# EasyEDA Pro project PCB_DengFOC V3PRO.epro

# Board PCB_DengFOC V3_2
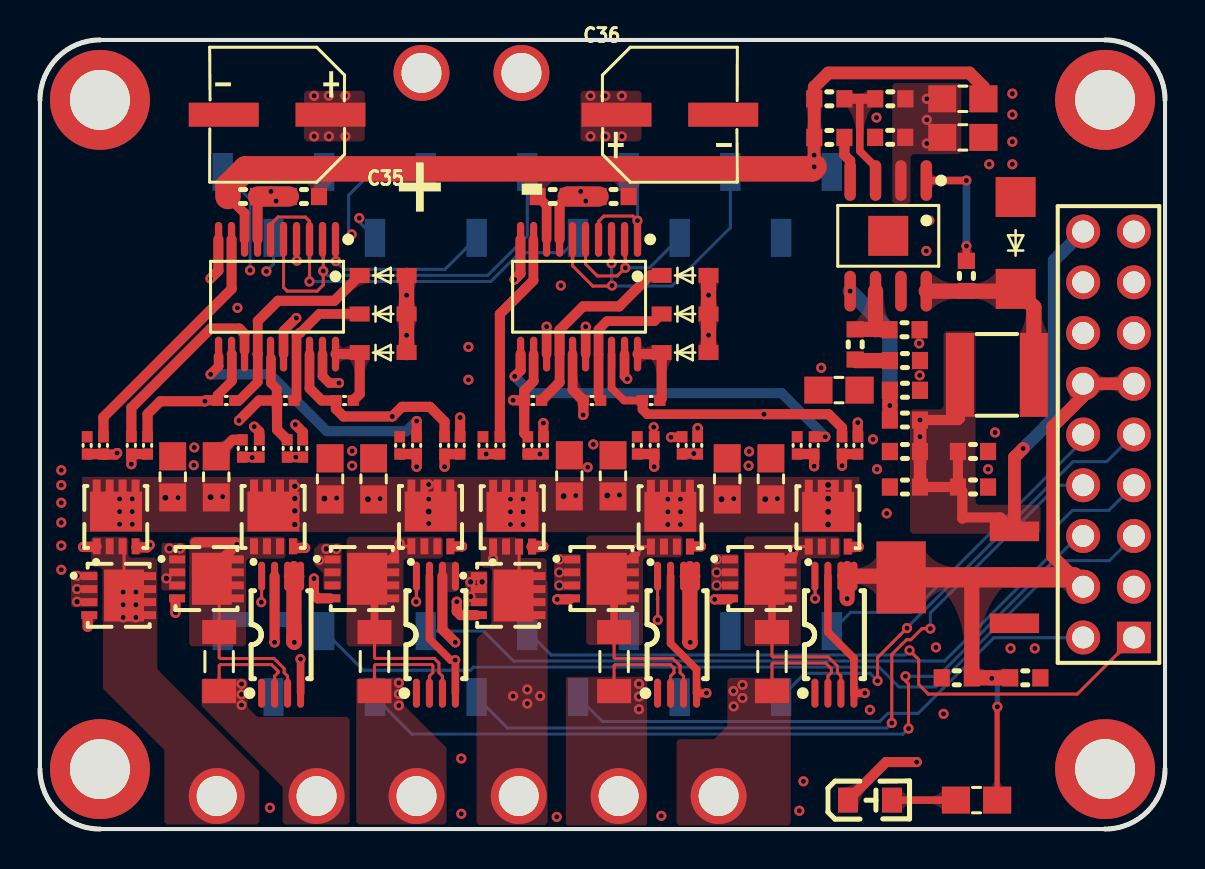
[diagram p0: board, top side]
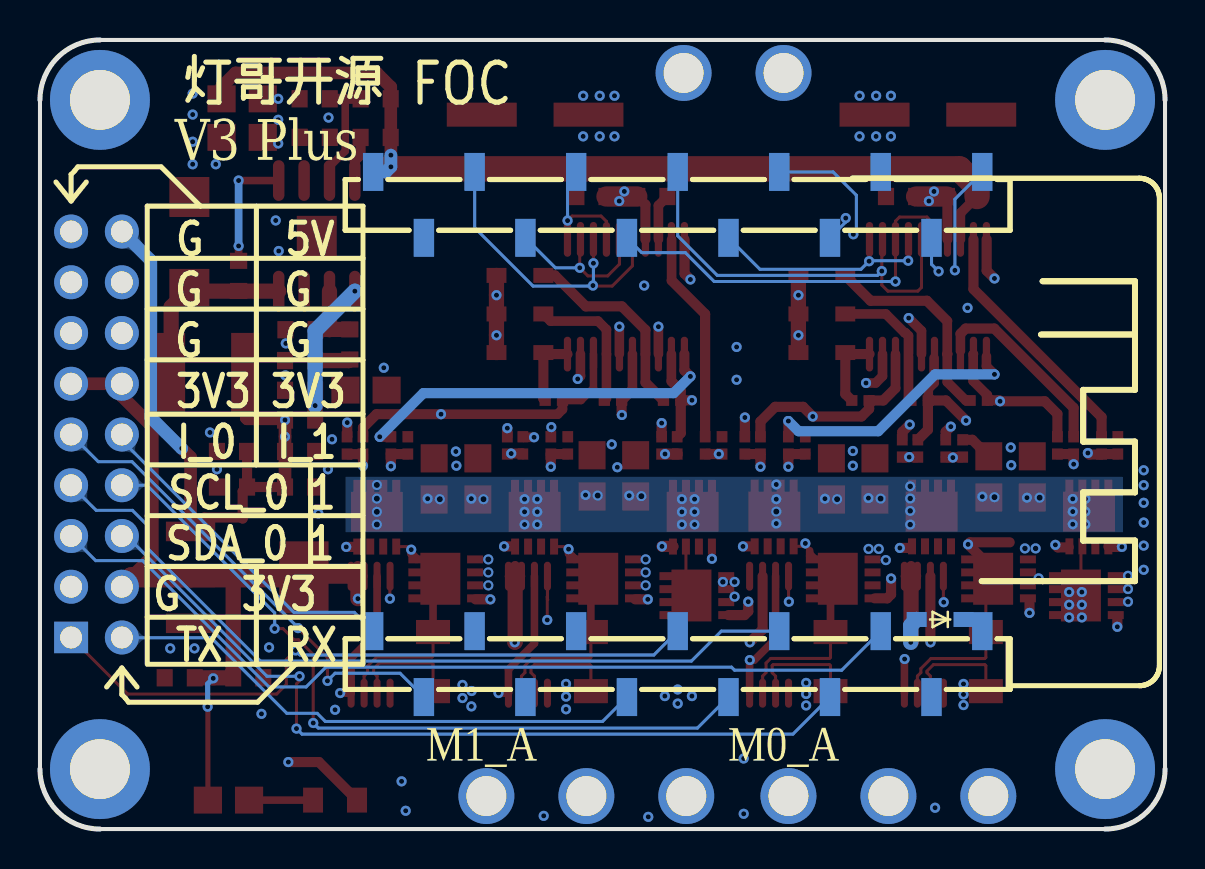
[diagram p1: board, bottom side, seen from below]

Outline 56.29 x 39.5 mm; copper layers: Top Layer, 内层1, 内层2, Bottom Layer. Coordinates in mm from the lower left corner of the outline.
Outline path: 0,36.5 arc(0.88,38.62) 3,39.5 53.29,39.5 arc(55.42,38.62) 56.29,36.5 56.29,3 arc(55.42,0.88) 53.29,0 3,0 arc(0.88,0.88) 0,3 0,36.5
Stack: Top Layer 0.035mm / Dielectric1 0.48mm PP er 4.5 / 内层1 0.035mm / Dielectric2 0.48mm FR4 er 4.5 / 内层2 0.035mm / Dielectric3 0.48mm PP er 4.5 / Bottom Layer 0.035mm

## Design rules (mm)
net M0_OUT2_N: DP1
net M0_OUT1_N: DP2
net M1_OUT2_N: DP3
net M1_OUT1_N: DP4
net M1_OUT1_P: DP4
net M0_OUT1_P: DP2
net M0_OUT2_P: DP1
net M1_OUT2_P: DP3
spacing Default (default): track to track 0.152, other pairs 0 to 0.152
track width Default (default): min 0.15, default 0.152, max 25.4
differential pair differentialPair (default): width min 0.127, default 0.254, max 2.54; gap min 0.152, default 0.152
via Default (default): diameter min 0.508, default 0.508, max 100.025; hole min 0.254, default 0.254, max 59.995
net PGND uses gge232172
net GND uses gge232286(1)

## Placement (name value [footprint] x y rotation side)
C1  47uF  [0603]  43.28 18.9 0 top
C2  47uF  [0603]  46.69 18.9 180 top
C3  4.7uF  [0805]  46.18 36.55 180 top
C4  100nF  [0603]  10.16 31.66 180 top
C5  100nF  [0603]  25.65 31.66 180 top
C7  10uF  [0805]  14.52 17.53 270 top
C8  4.7uF  [0805]  46.18 34.62 180 top
C9  100nF  [0402]  30.58 21.45 180 top
C10  100nF  [0603]  42.54 34.62 180 top
C11  10uF  [0805]  16.69 17.53 270 top
C12  8.2nF  [0603]  39.5 34.62 0 top
C13  100nF  [0402]  27.62 21.45 180 top
C14  1.2nF  [0603]  40.79 24.26 90 top
C15  10pF  [0603]  43.26 24.99 180 top
C16  100nF  [0402]  24.66 21.45 180 top
C17  100nF  [0603]  46.35 27.69 90 top
C18  10uF  [0805]  8.82 17.63 270 top
C19  10uF  [0805]  6.64 17.63 270 top
C21  100nF  [0402]  15.24 21.45 180 top
C23  100nF  [0402]  12.28 21.45 180 top
C24  100nF  [0603]  46.69 17.12 0 top
C25  10uF  [0805]  36.57 17.53 270 top
C26  100nF  [0603]  49.3 7.57 0 top
C27  22uF  [0603]  43.28 17.12 0 top
C28  22uF  [0603]  45.87 7.57 0 top
C29  100nF  [0402]  9.32 21.45 180 top
C30  10uF  [0805]  34.39 17.53 270 top
C31  10uF  [0805]  28.67 17.68 270 top
C32  10uF  [0805]  26.49 17.68 270 top
C33  1uF  [0603]  13.21 31.66 180 top
C34  1uF  [0603]  28.7 31.66 180 top
C35  100uF  [CAP-SMD_BD6.3-L6.6-W6.6-LS7.4-FD]  11.87 35.76 180 top
C36  100uF  [CAP-SMD_BD6.3-L6.6-W6.6-LS7.4-FD]  31.52 35.76 0 top
D2  SS34_C8678  [DO-214AC_L4.3-W2.7-LS5.3-RD]  48.82 29.34 90 top
D4  1N5819WS  [SOD-323_L1.8-W1.3-LS2.5-RD]  32.28 23.85 0 top
D6  1N5819WS  [SOD-323_L1.8-W1.3-LS2.5-RD]  32.28 25.78 0 top
D7  1N5819WS  [SOD-323_L1.8-W1.3-LS2.5-RD]  32.28 27.71 0 top
D8  1N5819WS  [SOD-323_L1.8-W1.3-LS2.5-RD]  17.17 27.71 0 top
D9  1N5819WS  [SOD-323_L1.8-W1.3-LS2.5-RD]  17.17 25.78 0 top
D10  1N5819WS  [SOD-323_L1.8-W1.3-LS2.5-RD]  17.17 23.85 0 top
D11  1N5819WS  [SOD-323_L1.8-W1.3-LS2.5-RD]  11.25 10.49 0 bottom
H1  Header-Female-2.54_2x9  [HDR-TH_18P-P2.54-V-R2-C9-S2.54]  53.47 19.75 90 top
H2  -  [SMD,P=2.54mm(交错脚)]  25.65 8.32 270 bottom
H3  -  [SMD,P=2.54mm(交错脚)]  25.65 31.31 270 bottom
L1  6.8uH  [IND-SMD_L5.0-W5.0_SWPA5040S]  47.88 22.73 180 top
LED1  17-21SUYC/TR8  [LED0805-RD]  41.53 1.45 0 top
NOREF  -  [Pad_e2262]  28.95 1.65 180 top
NOREF#2  -  [Pad_e2259]  13.84 1.65 180 top
NOREF#3  -  [Pad_e2068]  53.29 36.5 270 top
NOREF#4  -  [Pad_e2070]  19.09 37.85 180 top
NOREF#5  -  [Pad_e2069]  24.09 37.85 180 top
NOREF#6  -  [Pad_e2066]  3 3 270 top
NOREF#7  -  [Pad_e2260]  18.84 1.65 180 top
NOREF#8  -  [Pad_e2261]  23.96 1.65 180 top
NOREF#9  -  [Pad_e2263]  33.96 1.65 180 top
NOREF#10  -  [Pad_e2258]  8.84 1.65 180 top
NOREF#11  -  [Pad_e2067]  53.29 3 270 top
NOREF#12  -  [Pad_e2065]  3 36.5 270 top
Q1  WSD4070DN  [PDFN3333-8_L3.1-W3.2-P0.65-LS3.4-BL]  19.56 15.62 0 top
Q2  WSD4070DN  [PDFN3333-8_L3.1-W3.2-P0.65-LS3.4-BL]  16.1 12.52 270 top
Q3  WSD4070DN  [PDFN3333-8_L3.1-W3.2-P0.65-LS3.4-BL]  11.68 15.62 0 top
Q4  WSD4070DN  [PDFN3333-8_L3.1-W3.2-P0.65-LS3.4-BL]  8.33 12.52 270 top
Q5  WSD4070DN  [PDFN3333-8_L3.1-W3.2-P0.65-LS3.4-BL]  3.81 15.62 0 top
Q6  WSD4070DN  [PDFN3333-8_L3.1-W3.2-P0.65-LS3.4-BL]  3.94 11.68 270 top
Q7  WSD4070DN  [PDFN3333-8_L3.1-W3.2-P0.65-LS3.4-BL]  39.44 15.61 0 top
Q8  WSD4070DN  [PDFN3333-8_L3.1-W3.2-P0.65-LS3.4-BL]  35.99 12.52 270 top
Q9  WSD4070DN  [PDFN3333-8_L3.1-W3.2-P0.65-LS3.4-BL]  31.54 15.61 0 top
Q10  WSD4070DN  [PDFN3333-8_L3.1-W3.2-P0.65-LS3.4-BL]  28.09 12.52 270 top
Q11  WSD4070DN  [PDFN3333-8_L3.1-W3.2-P0.65-LS3.4-BL]  23.65 15.61 0 top
Q12  WSD4070DN  [PDFN3333-8_L3.1-W3.2-P0.65-LS3.4-BL]  23.43 11.68 270 top
R2  0  [0805]  39.98 21.97 0 top
R3  1K  [0805]  46.86 1.45 180 top
R4  330K  [0603]  42.55 36.55 0 top
R5  68K  [0603]  39.5 36.55 0 top
R6  30K  [0603]  43.28 23.45 180 top
R9  10K  [0603]  43.28 20.47 0 top
R10  1.87K  [0603]  43.28 21.96 180 top
R11  2.2Ω  [0402]  32.91 19.2 270 top
R12  2.2Ω  [0402]  30.73 19.2 270 top
R13  2.2Ω  [0402]  38.73 19.2 270 top
R14  2.2Ω  [0402]  40.93 19.2 270 top
R15  0.01  [R1206]  16.74 8.38 270 top
R16  0.01  [R1206]  8.97 8.38 270 top
R17  0.01  [R1206]  36.63 8.38 270 top
R18  0.01  [R1206]  28.73 8.38 270 top
R20  2.2Ω  [0402]  23.01 19.2 270 top
R21  2.2Ω  [0402]  25.19 19.2 270 top
R22  2.2Ω  [0402]  4.57 19.2 270 top
R23  2.2Ω  [0402]  3.17 19.2 270 top
R24  2.2Ω  [0402]  13.15 19.05 270 top
R25  2.2Ω  [0402]  10.97 19.05 270 top
R26  2.2Ω  [0402]  18.85 19.2 270 top
R27  2.2Ω  [0402]  21.02 19.2 270 top
R28  10kΩ  [R0402]  20.24 19.2 90 top
R29  10kΩ  [R0402]  18 19.2 90 top
R30  10kΩ  [R0402]  10.13 19.05 90 top
R31  10kΩ  [R0402]  12.37 19.05 90 top
R32  10kΩ  [R0402]  5.38 19.2 90 top
R33  10kΩ  [R0402]  2.36 19.2 90 top
R34  10kΩ  [R0402]  40.13 19.2 90 top
R35  10kΩ  [R0402]  37.89 19.2 90 top
R36  10kΩ  [R0402]  32.13 19.2 90 top
R37  10kΩ  [R0402]  29.89 19.2 90 top
R38  10kΩ  [R0402]  22.17 19.2 90 top
R39  10kΩ  [R0402]  24.41 19.2 90 top
U2  micropython esp32  [MICROPYTHON ESP32]  25.65 19.75 270 bottom
U3  TPS54331DDAR  [SOIC-8_L5.0-W4.0-P1.27-LS6.0-BL-EP]  42.44 29.69 180 top
U5  EG2133  [TSSOP-20_L6.5-W4.4-P0.65-LS6.4-BL]  26.97 26.64 180 top
U6  INA240A2PWR  [TSSOP-8_L4.4-W3.0-P0.65-LS6.4-BL]  19.81 9.73 0 top
U7  INA240A2PWR  [TSSOP-8_L4.4-W3.0-P0.65-LS6.4-BL]  12.06 9.73 0 top
U8  INA240A2PWR  [TSSOP-8_L4.4-W3.0-P0.65-LS6.4-BL]  39.75 9.73 0 top
U9  INA240A2PWR  [TSSOP-8_L4.4-W3.0-P0.65-LS6.4-BL]  31.88 9.73 0 top
U10  AMS1117-3.3  [SOT-223-4_L6.5-W3.5-P2.30-LS7.0-BR]  45.92 12.6 0 top
U11  EG2133  [TSSOP-20_L6.5-W4.4-P0.65-LS6.4-BL]  11.86 26.64 180 top

## Footprints (pads in the part's own frame, mm; a bottom-side part is the same pattern mirrored in y, then rotated)
0402
  rect 0.566x0.54 smd: 1(-0.433,0) 2(0.433,0)
0603
  rect 0.806x0.864 smd: 1(-0.753,0) 2(0.753,0)
0805
  rect 1.41x1.35 smd: 1(-1.03,0) 2(1.03,0)
CAP-SMD_BD6.3-L6.6-W6.6-LS7.4-FD
  rect 3.5x1.2 smd: 1(-2.67,0) 2(2.67,0)
DO-214AC_L4.3-W2.7-LS5.3-RD
  rect 2x2 smd: 1(-2.3,0) 2(2.3,0)
HDR-TH_18P-P2.54-V-R2-C9-S2.54
  rect 1.575x1.7 hole 1.1: 1(-10.16,-1.27)
  round 1.7 hole 1.1: 2(-10.16,1.27) 3(-7.62,-1.27) 4(-7.62,1.27) 5(-5.08,-1.27) 6(-5.08,1.27) 7(-2.54,-1.27) 8(-2.54,1.27) 9(0,-1.27) 10(0,1.27) 11(2.54,-1.27) 12(2.54,1.27) 13(5.08,-1.27) 14(5.08,1.27) 15(7.62,-1.27) 16(7.62,1.27) 17(10.16,-1.27) 18(10.16,1.27)
IND-SMD_L5.0-W5.0_SWPA5040S
  rect 1.4x4.2 smd: 1(-1.85,0) 2(1.85,0)
LED0805-RD
  rect 1x1.25 smd: 1(-1.1,0) 2(1.1,0)
Pad_e2065
  round 5 hole 3: N(0,0)
Pad_e2066
  round 5 hole 3: N(0,0)
Pad_e2067
  round 5 hole 3: N(0,0)
Pad_e2068
  round 5 hole 3: N(0,0)
Pad_e2069
  round 2.8 hole 2: 1(0,0)
Pad_e2070
  round 2.8 hole 2: 2(0,0)
Pad_e2258
  round 2.8 hole 2: 1(0,0)
Pad_e2259
  round 2.8 hole 2: 1(0,0)
Pad_e2260
  round 2.8 hole 2: 1(0,0)
Pad_e2261
  round 2.8 hole 2: 1(0,0)
Pad_e2262
  round 2.8 hole 2: 1(0,0)
Pad_e2263
  round 2.8 hole 2: 1(0,0)
PDFN3333-8_L3.1-W3.2-P0.65-LS3.4-BL
  rect 0.4x0.8 smd: 1(-0.975,-1.47) 2(-0.325,-1.47) 3(0.325,-1.47) 4(0.975,-1.47) 5(0.975,1.47) 6(0.325,1.47) 7(-0.325,1.47) 8(-0.975,1.47)
  rect 2.6x2 smd: 9(-0.004,0.27)
R0402
  rect 0.566x0.54 smd: 1(-0.433,0) 2(0.433,0)
R1206
  rect 1.208x1.701 smd: 1(-1.479,0) 2(1.479,0)
SMD,P=2.54mm(交错脚)
  rect 1.9x1.02 smd: 1(-1.587,16.51) 2(1.714,13.97) 3(-1.587,11.43) 4(1.714,8.89) 5(-1.587,6.35) 6(1.714,3.81) 7(-1.587,1.27) 8(1.714,-1.27) 9(-1.587,-3.81) 10(1.714,-6.35) 11(-1.587,-8.89) 12(1.714,-11.43) 13(-1.587,-13.97)
SOD-323_L1.8-W1.3-LS2.5-RD
  rect 1x0.75 smd: 1(-1.173,0) 2(1.173,0)
SOIC-8_L5.0-W4.0-P1.27-LS6.0-BL-EP
  oval 0.574x2.038 smd: 1(-1.905,-2.769) 2(-0.635,-2.769) 3(0.635,-2.769) 4(1.905,-2.769) 5(1.905,2.769) 6(0.635,2.769) 7(-0.635,2.769) 8(-1.905,2.769)
  rect 2x2 smd: 9(0,0)
SOT-223-4_L6.5-W3.5-P2.30-LS7.0-BR
  rect 2.47x0.98 smd: 1(2.835,-2.3) 2(2.835,0) 3(2.835,2.3)
  rect 2.47x3.6 smd: 4(-2.835,0)
TSSOP-8_L4.4-W3.0-P0.65-LS6.4-BL
  oval 0.353x1.454 smd: 1(-0.975,-2.927) 2(-0.325,-2.927) 3(0.325,-2.927) 4(0.975,-2.927) 5(0.975,2.927) 6(0.325,2.927) 7(-0.325,2.927) 8(-0.975,2.927)
TSSOP-20_L6.5-W4.4-P0.65-LS6.4-BL
  oval 0.364x1.742 smd: 1(-2.925,-2.871) 2(-2.275,-2.871) 3(-1.625,-2.871) 4(-0.975,-2.871) 5(-0.325,-2.871) 6(0.326,-2.871) 7(0.976,-2.871) 8(1.625,-2.871) 9(2.276,-2.871) 10(2.925,-2.871) 11(2.925,2.871) 12(2.276,2.871) 13(1.625,2.871) 14(0.976,2.871) 15(0.326,2.871) 16(-0.325,2.871) 17(-0.975,2.871) 18(-1.625,2.871) 19(-2.275,2.871) 20(-2.925,2.871)

## Nets
3V3: C26.1 C28.2 D11.2 H1.4 H1.11 H1.12 R3.1 U6.5 U6.6 U7.5 U7.6 U8.5 U8.6 U9.5 U9.6 U10.2 U10.4
5V: C1.2 C2.2 C4.1 C5.1 C24.1 C27.2 C33.2 C34.2 D4.2 D6.2 D7.2 D8.2 D9.2 D10.2 H1.18 L1.2 R9.2 U5.7 U10.3 U11.7
GND: C1.1 C2.1 C3.1 C4.2 C5.2 C8.1 C10.2 C12.1 C15.1 C24.2 C26.2 C27.1 C28.1 C33.1 C34.1 D2.2 H1.3 H1.13 H1.14 H1.15 H1.16 H1.17 H3.13 LED1.1 NOREF#3.N NOREF#11.N R2.2 R5.1 R6.1 R10.1 U3.7 U3.9 U5.8 U6.4 U6.7 U7.4 U7.7 U8.4 U8.7 U9.4 U9.7 U10.1 U11.8
PGND: C7.1 C11.1 C18.1 C19.1 C25.1 C30.1 C31.1 C32.1 C35.2 C36.2 NOREF#5.1 NOREF#6.N NOREF#12.N Q2.1 Q2.2 Q2.3 Q4.1 Q4.2 Q4.3 Q6.1 Q6.2 Q6.3 Q8.1 Q8.2 Q8.3 Q10.1 Q10.2 Q10.3 Q12.1 Q12.2 Q12.3 R2.1 R29.2 R30.2 R33.2 R35.2 R37.2 R38.2
VIN: C3.2 C7.2 C8.2 C10.1 C11.2 C18.2 C19.2 C25.2 C30.2 C31.2 C32.2 C35.1 C36.1 NOREF#4.2 Q1.5 Q1.6 Q1.7 Q1.8 Q1.9 Q3.5 Q3.6 Q3.7 Q3.8 Q3.9 Q5.5 Q5.6 Q5.7 Q5.8 Q5.9 Q7.5 Q7.6 Q7.7 Q7.8 Q7.9 Q9.5 Q9.6 Q9.7 Q9.8 Q9.9 Q11.5 Q11.6 Q11.7 Q11.8 Q11.9 R4.2 U3.2
I_0: H1.9 H2.12
I_1: H1.10 H2.13
M0_EN: H2.2
M0_GH1: R27.1 U11.19
M0_GH2: R24.1 U11.16
M0_GH3: R22.1 U11.13
M0_GL1: R26.1 U11.11
M0_GL2: R25.1 U11.10
M0_GL3: R23.1 U11.9
M0_IN1: H3.6 U11.1 U11.4
M0_IN2: H3.7 U11.2 U11.5
M0_IN3: H3.8 U11.3 U11.6
M0_OUT1_CS: H3.2 U6.8
M0_OUT1_N: NOREF#7.1 R15.2 U6.2
M0_OUT1_P: C21.2 Q1.1 Q1.2 Q1.3 Q2.5 Q2.6 Q2.7 Q2.8 Q2.9 R15.1 R28.2 U6.3 U11.18
M0_OUT2_CS: H3.1 U7.8
M0_OUT2_N: NOREF#2.1 R16.2 U7.2
M0_OUT2_P: C23.2 Q3.1 Q3.2 Q3.3 Q4.5 Q4.6 Q4.7 Q4.8 Q4.9 R16.1 R31.2 U7.3 U11.15
M0_OUT3: C29.2 NOREF#10.1 Q5.1 Q5.2 Q5.3 Q6.5 Q6.6 Q6.7 Q6.8 Q6.9 R32.2 U11.12
M1_EN: H3.12
M1_GH1: R14.1 U5.19
M1_GH2: R11.1 U5.16
M1_GH3: R21.1 U5.13
M1_GL1: R13.1 U5.11
M1_GL2: R12.1 U5.10
M1_GL3: R20.1 U5.9
M1_IN1: H3.9 U5.1 U5.4
M1_IN2: H3.10 U5.2 U5.5
M1_IN3: H3.11 U5.3 U5.6
M1_OUT1_CS: H3.5 U8.8
M1_OUT1_N: NOREF#9.1 R17.2 U8.2
M1_OUT1_P: C9.2 Q7.1 Q7.2 Q7.3 Q8.5 Q8.6 Q8.7 Q8.8 Q8.9 R17.1 R34.2 U5.18 U8.3
M1_OUT2_CS: H3.4 U9.8
M1_OUT2_N: NOREF.1 R18.2 U9.2
M1_OUT2_P: C13.2 Q9.1 Q9.2 Q9.3 Q10.5 Q10.6 Q10.7 Q10.8 Q10.9 R18.1 R36.2 U5.15 U9.3
M1_OUT3: C16.2 NOREF#8.1 Q11.1 Q11.2 Q11.3 Q12.5 Q12.6 Q12.7 Q12.8 Q12.9 R39.2 U5.12
RXD: H1.2 H2.8
SCL_0: H1.7 H2.5
SCL_1: H1.8 H2.6
SDA_0: H1.5 H2.3
SDA_1: H1.6 H2.4
TXD: H1.1 H2.7
$1N75: LED1.2 R3.2
$1N530: R9.1 R10.2 U3.5
$1N531: C17.1 D2.1 L1.1 U3.8
$1N532: C17.2 U3.1
$1N535: C14.2 C15.2 U3.6
$1N536: C12.2 U3.4
$1N538: R4.1 R5.2 U3.3
$1N1312: C23.1 D9.1 U11.17
$1N1315: C29.1 D8.1 U11.14
$1N1336: C21.1 D10.1 U11.20
$1N1359: C9.1 D4.1 U5.20
$1N1370: C16.1 D7.1 U5.14
$1N1373: C13.1 D6.1 U5.17
$1N1444: C14.1 R6.2
$1N6010: Q7.4 R14.2 R34.1
$1N6048: Q8.4 R13.2 R35.1
$1N6067: Q9.4 R11.2 R36.1
$1N6091: Q10.4 R12.2 R37.1
$1N6102: Q12.4 R20.2 R38.1
$1N6136: Q11.4 R21.2 R39.1
$1N6143: Q6.4 R23.2 R33.1
$1N6154: Q5.4 R22.2 R32.1
$1N6178: Q4.4 R25.2 R30.1
$1N6189: Q3.4 R24.2 R31.1
$1N6225: Q2.4 R26.2 R29.1
$1N6232: Q1.4 R27.2 R28.1
$1N7980: D11.1 H2.1

Pads without a net: H2 9 10 11; H3 3; U6 1; U7 1; U8 1; U9 1

## Via types
v1: diameter 0.508, hole 0.254, Top Layer to Bottom Layer, 220 vias
v2: diameter 0.508, hole 0.305, Top Layer to Bottom Layer, 19 vias
v3: diameter 0.508, hole 0.28, Top Layer to Bottom Layer, 16 vias

## Routing (per net, layer and track width the routed paths; a pad name or vN(x,y) marks a point on that pad's centre or on a via; arc(x,y) is an arc through that point)
3V3: length 83.8
  Top Layer w0.254: v1(47.62,7.54) 47.62,7.55 47.62,7.57 ; R3.1 47.89,6.11 v1(47.9,6.12)
  Top Layer w0.381: U9.5 U9.6 ; U7.6 U7.5 ; U8.6 40.39,12.66
  Top Layer w0.508: v1(20.78,9.35) 20.14,9.99 U6.6 ; 40.39,13.16 40.39,12.66 ; 32.52,13.16 32.52,12.66 ; 12.71,13.16 12.71,12.66
  Top Layer w0.635: 51.73,12.6 50.67,13.65 50.67,20.14 52.2,21.67 H1.12 H1.11
  Top Layer w0.762: U10.4 43.03,12.66 U8.5 ; 32.52,12.66 32.52,9.37 v1(32.54,9.35) ; 12.71,12.66 12.71,9.61 12.7,9.6 12.7,9.37 v1(12.73,9.35) ; 40.39,12.66 U8.5 ; U8.5 40.39,12.32 v1(40.39,11.53) ; C26.1 C28.2 46.63,12.49 46.73,12.6
  Top Layer w1.016: U10.4 U10.2 51.73,12.6 H1.4
  内层2 w0.762: v1(40.39,11.53) 40.39,10.26 39.47,9.35 v1(32.54,9.35) v1(20.78,9.35) v1(12.73,9.35)
  Bottom Layer w0.254: v1(47.9,6.12) 47.9,7.26 v1(47.62,7.54)
  Bottom Layer w0.762: v1(12.73,9.35) 12.73,10.19 D11.2
5V: length 98.4
  Top Layer w0.508: 45.93,18.9 45.93,17.12 ; 45.93,17.12 C27.2 ; 45.93,17.12 46.15,16.9 46.15,15.55 46.2,15.6 48.06,15.6 U10.3 ; v1(44.03,20.47) 45.95,20.47 46.03,20.55 L1.2 ; U5.7 26,31.25 C5.1 ; U11.7 10.89,31.63
  Top Layer w0.635: C27.2 C1.2 v1(44.03,19.64) v1(44.03,20.47) ; v1(49.2,19.05) 48.76,18.61 U10.3
  Top Layer w0.762: D10.2 D9.2 D8.2 ; 33.45,27.71 v1(33.45,26.72) v1(33.45,24.71) ; 33.45,24.71 D4.2
  Top Layer w1.016: C34.2 C5.1 ; C33.2 C4.1
  内层2 w0.762: v1(33.45,24.71) v1(33.45,26.72) 35.92,29.18 36.04,29.18 ; 18.38,31.72 18.34,31.69 v1(18.34,26.72) v1(18.34,24.71)
  内层2 w1.27: 36.04,29.18 36.04,29.21 ; 36.04,29.18 33.5,31.72 11.75,31.72 ; 36.04,29.18 44.03,21.2 v1(44.03,20.47) v1(44.03,19.64)
  Bottom Layer w0.635: v1(49.2,19.05) 50.75,20.6 50.75,28.46 H1.18
  vias: v1(11.56,31.92) v1(11.82,31.43) v1(27.06,31.92) v1(27.31,31.43)
GND: length 112.3
  Top Layer w0.381: U6.4 20.79,8.45 v1(20.78,8.46) 20.55,8.46 19.49,9.52 U6.7 ; v1(13.03,8.51) 13.04,8.5 U7.4 ; v1(33.35,6.81) 33.34,6.8 U9.4 32.85,7.99 31.55,9.29 U9.7 ; 39.43,12.66 39.43,9.85 40.73,8.55 U8.4 41.27,6.8 v1(41.28,6.81)
  Top Layer w0.482: C5.2 25.35,31.21 U5.8 ; U11.8 10.24,30.83 C4.2
  Top Layer w0.508: v1(43.87,3.35) 42.33,3.35 LED1.1 ; v1(11.73,9.35) 11.74,9.35 U7.7
  Top Layer w0.635: v1(38.73,33.15) v1(38.73,33.73) 38.73,34.61 C12.1 R5.1 38.74,37.14 39.45,37.85 46.51,37.85 47.21,37.15 C3.1
  Top Layer w1.27: v1(38.73,33.15) 38.63,33.05 10.29,33.05 9.41,32.17 C4.2
  内层2 w0.762: 33.34,8.31 39.78,8.31 v1(41.28,6.81) ; 33.34,8.31 33.35,8.3 v1(33.35,6.81) ; 33.34,8.31 12.27,8.31 11.73,8.84 v1(11.73,9.35)
  Bottom Layer w0.635: v1(38.73,33.73) v1(38.73,33.15) 38.99,32.89 H3.13
  vias: v1(41.53,5.97) v1(41.68,19.51) v1(41.88,18.01) v1(42.37,15.8) v1(43.99,24.31) v1(44.02,22.71) v1(44.35,28.93) v1(44.5,30.46) v1(44.83,9.09) v1(45.21,5.77) v1(47.5,33.27) v1(47.44,18.01) v1(47.79,19.85) v1(48.56,9.04) v1(48.65,36.81) v1(48.65,35.76) v1(48.65,34.4) v1(48.65,33.27) v1(49.78,9.04)
PGND: length 1.6
  Top Layer w0.508: C18.1 9.64,19.48 R30.2
  vias: v1(1.07,17.96) v1(1.07,17.21) v1(1.07,16.33) v1(1.07,15.34) v1(1.07,14.19) v1(1.07,12.98) v1(7.7,18.21) v1(7.72,19.1) v1(9.88,26.09) v1(11.51,1.07) v1(15.62,18.92) v1(15.62,18.19) v1(21.08,3.53) v1(21.08,0.76) v1(21.44,24.13) v1(21.44,22.49) v1(25.86,0.61) v1(26.06,27.2) v1(27.41,18.11) v1(27.69,19.25) v1(31.09,0.66) v1(35.48,18.9) v1(35.46,18.19) v1(38,0.91) v1(38.2,2.39) v1(39.09,23.09) v2(25.99,13.5) v2(25.99,12.85) v2(25.99,12.2) v2(33.86,13.5) v2(33.86,12.85) v2(33.86,12.2) v3(1.85,12.67) v3(1.85,12.01) v3(1.85,11.38) v3(6.32,12.55) v3(6.48,14.05) v3(7.01,14.05) v3(13.97,13.46) v3(14.33,14.02) v3(14.83,14.02) v3(21.54,12.37) v3(21.54,11.63) v3(22.12,12.37)
VIN:
  vias: v1(3.98,16.53) v1(3.98,15.89) v1(3.98,15.26) v1(4.62,16.53) v1(4.62,15.89) v1(4.62,15.26) v1(6.91,16.59) v1(9.14,16.64) v1(13.72,36.7) v1(13.72,34.67) v1(14.45,36.7) v1(14.46,34.67) v1(14.84,16.57) v1(15.28,36.7) v1(15.29,34.67) v1(17.02,16.54) v1(19.45,17.25) v1(19.45,16.51) v1(19.45,15.29) v1(23.54,16.51) v1(23.54,15.88) v1(23.54,15.24) v1(24.18,16.51) v1(24.18,15.88) v1(24.18,15.24) v1(26.81,16.69) v1(27.55,36.7) v1(27.55,34.67) v1(28.29,36.7) v1(28.29,34.67) v1(29,16.72) v1(29.11,36.7) v1(29.12,34.67) v1(31.41,16.51) v1(31.41,15.88) v1(31.41,15.24) v1(32.05,16.51) v1(32.05,15.88) v1(32.05,15.24) v1(34.71,16.54) v1(36.9,16.54) v1(41.86,35.61) v1(44.37,36.55) v1(44.37,35.5) v1(44.37,34.32) v2(6.27,16.59) v2(8.53,16.61) v2(14.23,16.54) v2(16.41,16.51) v2(19.45,15.89) v2(26.2,16.66) v2(28.39,16.69) v2(34.1,16.51) v2(36.29,16.51) v2(39.44,17.22) v2(39.44,16.54) v2(39.44,15.88) v2(39.44,15.24) v3(12.75,17.16) v3(12.75,16.55) v3(12.75,15.93) v3(12.75,15.24)
I_0: length 24.1
  Top Layer w0.152: v1(43.38,10.06) 41.91,8.59 v1(41.91,7.42)
  Bottom Layer w0.152: v1(43.38,10.06) 43.38,10.08 51.69,18.39 53.38,18.39 H1.9 ; v1(41.91,7.42) 41.53,7.8 38.28,7.8 H2.12
I_1: length 16.8
  Bottom Layer w0.152: H2.13 40.56,10.85 43.59,10.85 52.2,19.46 H1.10
M0_GH1: length 9.8
  Top Layer w0.482: U11.19 14.14,22.67 14.48,22.33 v1(14.96,22.33)
  Top Layer w0.508: R27.1 v1(21.02,20.6)
  内层2 w0.508: v1(21.02,20.6) 19.63,20.6 17.91,22.33 v1(14.96,22.33)
M0_GH2: length 8.3
  Top Layer w0.482: v1(12.83,25.58) 12.19,24.94 U11.16
  Top Layer w0.508: v1(12.78,20.24) 13.15,19.87 R24.1
  内层2 w0.508: v1(12.78,20.24) 12.78,25.53 v1(12.83,25.58)
M0_GH3: length 9.7
  Top Layer w0.482: 10.24,24.79 10.24,23.94
  Top Layer w0.508: 10.24,24.79 9.98,25.05 8.54,25.05 4.57,21.08 R22.1
M0_GL1: length 13.6
  Top Layer w0.152: v1(18.85,20.42) 18.82,20.4
  Top Layer w0.482: v1(8.53,22.76) 8.94,23.16 8.94,23.66
  Top Layer w0.508: v1(18.85,20.42) R26.1
  Bottom Layer w0.508: v1(8.53,22.76) 11.51,22.76 14.35,19.91 18.34,19.91 v1(18.85,20.42)
M0_GL2: length 11.8
  Top Layer w0.508: v1(8.53,27.56) 8.93,27.95 8.93,29.52 ; v1(10.72,20.14) 10.97,19.89 R25.1
  内层2 w0.508: v1(8.53,27.56) 9.6,27.56 10.72,26.44 v1(10.72,20.14)
M0_GL3: length 12.5
  Top Layer w0.508: R23.1 3.17,20.62 9.59,27.03 U11.9
M0_IN1: length 12
  Top Layer w0.152: U11.1 14.79,28.4 v1(14.81,28.42) ; U11.4 12.84,28.46 v1(12.85,28.45)
  Bottom Layer w0.152: H3.6 20.27,28.02 15.21,28.02 v1(14.81,28.42) 14.78,28.45 v1(12.85,28.45)
M0_IN2: length 21.1
  Top Layer w0.152: 14.14,29.49 14.17,29.45 v1(14.17,27.93) 14.17,27.23 13.87,26.92 12.37,26.92 12.19,27.11 12.19,29.47
  Bottom Layer w0.152: H3.7 24.38,29.69 22.4,27.71 14.39,27.71 v1(14.17,27.93)
M0_IN3: length 20.3
  Top Layer w0.152: 13.49,27.41 U11.3 13.49,30.43 13.28,30.63 11.91,30.63 11.54,30.26 U11.6
  Bottom Layer w0.152: H3.8 26.19,28.85 24.01,28.85 22.56,27.41 v1(13.49,27.41)
M0_OUT1_CS: length 26.9
  Top Layer w0.152: v1(18.82,11.38) 18.84,11.39 U6.8
  内层2 w0.152: v1(11.33,27.91) 11.58,27.66 11.58,11.99 12.55,11.02 18.47,11.02 v1(18.82,11.38)
  Bottom Layer w0.152: v1(11.33,27.91) 11.68,28.27 H3.2
M0_OUT1_N: length 5.7
  Top Layer w0.152: R15.2 16.74,8.18 16.79,8.23 19.61,8.23 19.66,8.18 19.66,7.83 19.49,7.66 U6.2
  vias: v1(17.96,7.32) v1(17.96,6.76) v1(17.96,6.19)
M0_OUT1_P: length 29.5
  Top Layer w0.152: 17.66,13.59 17.57,13.5 ; U6.3 20.14,7.66 19.96,7.83 19.96,8.31 19.73,8.54 16.79,8.54 16.74,8.59 R15.1 ; Q1.1 18,14.15 17.78,13.93 16.37,12.53
  Top Layer w0.381: R15.1 16.74,12.16 16.37,12.53 ; 17.78,13.93 17.78,13.7 17.66,13.59
  Top Layer w0.482: 13.49,22.06 13.49,23.77
  Top Layer w0.508: R28.2 20.24,20.4 19.51,21.13 18.11,21.13 v1(17.63,20.65) 15.19,20.65 14.81,21.03 C21.2 14.1,21.45 13.49,22.06
  内层2 w0.508: v1(17.63,20.65) 18,20.28 v1(18,14.3)
M0_OUT2_CS: length 23.8
  Top Layer w0.152: U7.8 11.09,11.37 v1(11.07,11.35)
  内层2 w0.152: v1(10.52,27.97) 10.52,27.71 11.23,27 11.23,11.51 v1(11.07,11.35)
  Bottom Layer w0.152: v1(10.52,27.97) 10.52,31.52 H3.1
M0_OUT2_N: length 5.6
  Top Layer w0.152: R16.2 8.97,8.18 9.02,8.23 11.59,8.23 11.91,7.9 11.91,7.83 11.74,7.66 U7.2
  vias: v1(10.08,7.26) v1(10.08,6.74) v1(10.08,6.21)
M0_OUT2_P: length 26.2
  Top Layer w0.152: U7.3 12.39,7.66 12.22,7.83 12.22,8.03 11.71,8.53 9.02,8.53 8.97,8.59 R16.1 8.97,12.16 8.6,12.53
  Top Layer w0.482: 11.56,23.57 11.56,22.33 11.85,22.04 11.85,21.45
  Top Layer w0.508: 8.6,12.53 8.6,13 v1(9.86,14.25) 9.75,14.35 7.77,14.35 ; R31.2 11.86,19.99 11.86,21.44 11.85,21.45 10.96,21.45 v1(9.96,20.45)
  内层2 w0.508: v1(9.96,20.45) 9.86,20.35 v1(9.86,14.25)
M0_OUT3: length 22.7
  Top Layer w0.152: Q5.3 4.21,14.08 Q6.9
  Top Layer w0.482: U11.12 9.6,23.76 9.6,22.43 8.89,21.72 C29.2
  Top Layer w0.508: C29.2 8.88,21.46 8.31,21.46 v1(8.25,21.41) 6.02,21.41 5.38,20.78 R32.2 ; Q5.1 2.81,14.12 v1(2.16,14.12)
  内层2 w0.508: v1(2.16,14.12) 2.49,14.45 2.49,19.36 4.55,21.41 v1(8.25,21.41)
  vias: v1(4.16,11.86) v1(4.16,11.23) v1(4.16,10.59) v1(4.8,11.86) v1(4.8,11.23) v1(4.8,10.59)
M1_GH1: length 14.5
  Top Layer w0.482: U5.19 29.25,22.67 v1(29.39,22.53)
  Top Layer w0.508: 40.93,19.63 40.92,19.64 v1(40.92,20.35)
  内层2 w0.508: v1(29.39,22.53) 36.78,22.53 38.96,20.35 v1(40.92,20.35)
  Bottom Layer w0.152: 29.44,22.58 v1(29.39,22.53)
M1_GH2: length 10.6
  Top Layer w0.482: v1(27.31,25.15) 27.31,23.78
  Top Layer w0.508: R11.1 v1(32.91,20.07)
  内层2 w0.482: v1(27.31,25.15) 27.31,23.27 28.73,21.84 31.13,21.84
  内层2 w0.508: v1(32.91,20.07) 31.13,21.84
M1_GH3: length 6.9
  Top Layer w0.482: v1(25.35,25.15) U5.13
  Top Layer w0.508: R21.1 v1(25.19,20.32)
  内层2 w0.508: v1(25.35,25.15) 25.35,20.48 v1(25.19,20.32)
M1_GL1: length 18.6
  Top Layer w0.508: v1(23.75,22.66) 24.05,22.96 U5.11 ; v1(39.29,19.63) 38.74,19.63
  Bottom Layer w0.508: v1(39.29,19.63) 37.11,21.82 24.59,21.82 v1(23.75,22.66)
M1_GL2: length 14.1
  Top Layer w0.152: v1(30.71,20.12) 30.71,19.66 R12.1
  Top Layer w0.508: 24.04,29.51 24.04,27.8 v1(23.75,27.51)
  内层2 w0.508: v1(30.71,20.12) 29.64,21.18 28.14,21.18 26.14,23.19 26.14,25.63 24.26,27.51 v1(23.75,27.51)
M1_GL3: length 10.6
  Top Layer w0.482: 24.69,27.46 24.69,29.51
  Top Layer w0.508: R20.1 23.01,25.78 24.69,27.46
M1_IN1: length 6.6
  Top Layer w0.152: U5.4 27.95,30.41 28.22,30.68 29.67,30.68 v1(29.9,30.45) 29.9,29.52 29.9,29.52
  Bottom Layer w0.152: v1(29.9,30.45) 29.9,32.46 H3.9
M1_IN2: length 8.4
  Top Layer w0.152: U5.2 29.29,29.48 v1(29.29,28.09) 28.88,27.69 27.89,27.69 27.3,28.28 U5.5
  Bottom Layer w0.152: H3.10 30.5,28.09 v1(29.29,28.09)
M1_IN3: length 16
  Top Layer w0.152: v1(28.6,28.32) U5.3 ; U5.6 26.65,28.19 27.66,27.18 28.6,27.18 v1(28.63,27.2)
  Bottom Layer w0.152: v1(28.6,28.32) 28.6,27.23 v1(28.63,27.2) 28.65,27.18 31.62,27.18 34.54,30.1 H3.11
M1_OUT1_CS: length 56.8
  Top Layer w0.152: v1(38.79,11.53) 38.79,12.65 U8.8
  内层2 w0.152: v1(15.6,29.77) 15.27,30.1 12.52,30.1 12.27,29.85 12.27,12.17 12.72,11.71 17.91,11.71 18.39,12.19 19.18,12.19 20.9,10.47 29.18,10.47 29.67,10.95 38.2,10.95 v1(38.79,11.53)
  Bottom Layer w0.152: H3.5 16.61,32.89 15.44,31.72 15.44,29.92 v1(15.6,29.77)
M1_OUT1_N: length 5.8
  Top Layer w0.152: R17.2 36.63,8.25 36.68,8.31 39.32,8.31 39.6,8.03 39.6,7.83 39.43,7.66 39.43,6.8
  vias: v1(34.7,6.91) v1(34.71,6.14) v1(35.15,7.21) v1(35.15,6.56)
M1_OUT1_P: length 34.6
  Top Layer w0.152: U8.3 40.08,7.66 39.9,7.83 39.9,8.15 39.45,8.61 36.68,8.61 36.63,8.66 R17.1 ; Q7.1 37.87,14.14 v1(37.72,13.98) 36.26,12.53
  Top Layer w0.381: 28.6,23.77 28.6,22.07 29.22,21.45 C9.2 ; 36.26,12.53 36.63,12.16 R17.1 ; 37.46,13.5 37.72,13.75 v1(37.72,13.98)
  Top Layer w0.482: C9.2 30.15,21.01 30.39,20.76 v1(36.23,20.76)
  Top Layer w0.508: R34.2 40.13,20.09 39.46,20.76 v1(36.23,20.76)
  内层2 w0.508: v1(37.72,13.98) 37.72,19.27 v1(36.23,20.76)
M1_OUT2_CS: length 46.2
  Top Layer w0.152: 30.9,11.64 30.91,11.63 v1(30.91,10.47) ; 30.9,11.64 30.9,11.5 30.89,11.48 ; 30.9,11.64 30.9,12.66
  内层2 w0.152: v1(15.98,30.58) 12.52,30.58 11.96,30.02 11.96,12.04 12.67,11.33 17.96,11.33 18.52,11.89 19.05,11.89 20.78,10.16 30.61,10.16 v1(30.91,10.47)
  Bottom Layer w0.152: v1(15.98,30.58) 15.98,30.38 H3.4
M1_OUT2_N: length 5.7
  Top Layer w0.152: U9.2 31.55,7.66 31.72,7.83 31.72,8.05 31.55,8.23 28.78,8.23 28.73,8.18 R18.2
  vias: v1(29.97,7.26) v1(29.97,6.63) v1(29.97,6)
M1_OUT2_P: length 27.3
  Top Layer w0.152: U9.3 32.2,7.66 32.03,7.83 32.03,8.18 31.67,8.53 28.78,8.53 28.73,8.59 R18.1 ; 28.36,12.53 v1(29.84,14.01) 29.97,14.14 Q9.1
  Top Layer w0.381: R18.1 28.73,12.16 28.36,12.53 ; v1(29.84,14.01) 29.84,13.78 29.56,13.5
  Top Layer w0.482: R36.2 32.1,19.61 v1(31.57,19.61) ; 26.65,21.99 U5.15
  Top Layer w0.508: 26.65,21.99 C13.2 27.19,20.74 v1(27.18,20.73)
  内层2 w0.482: v1(31.57,19.61) 31.05,19.09 29.84,19.09
  内层2 w0.508: v1(29.84,14.01) 29.84,19.84 29.51,20.17 27.58,20.17 27.18,20.57 v1(27.18,20.73)
M1_OUT3: length 16.2
  Top Layer w0.152: 23.96,11.43 Q12.9 23.97,11.96 Q11.3
  Top Layer w0.482: 24.7,22.41 U5.12
  Top Layer w0.508: C16.2 24.23,19.81 R39.2 ; C16.2 24.22,21.46 v1(23.67,21.46) ; C16.2 24.23,21.94 24.7,22.41
  内层2 w0.508: v1(23.67,21.46) 23.39,21.18 23.39,18.57 22.67,17.85 v1(22.67,13.53)
  vias: v1(23.67,6.66) v1(24.38,6.99) v1(24.38,6.28) v1(25.03,6.66)
RXD: length 27.5
  Bottom Layer w0.152: H1.2 52.18,9.58 47.73,9.58 43.94,5.79 42.42,5.79 42.01,5.39 28.14,5.39 H2.8
SCL_0: length 40.4
  Bottom Layer w0.152: H2.5 22.2,9.91 23.7,8.41 45.26,8.41 50.93,14.07 50.93,15.21 51.66,15.95 53.48,15.95 H1.7
SCL_1: length 38.5
  Top Layer w0.152: v1(44.55,10.03) 44.13,10.03 43.57,9.47 43.36,9.47 42.62,8.74 v1(42.62,5.31)
  Bottom Layer w0.152: H1.8 50.94,17.21 44.55,10.82 v1(44.55,10.03) ; H2.6 23.39,5.05 42.37,5.05 v1(42.62,5.31)
SDA_0: length 44.9
  Bottom Layer w0.152: H2.3 16.18,7.95 21.54,7.95 21.69,8.1 41.99,8.1 42.98,7.11 44.83,7.11 51.16,13.44 53.5,13.44 H1.5
SDA_1: length 42.1
  Top Layer w0.152: v1(43.31,7.65) 43.31,7.42 43.46,7.26 v1(43.46,5.03)
  Bottom Layer w0.152: H1.6 51.96,14.67 44.93,7.65 v1(43.31,7.65) ; v1(43.46,5.03) 43.18,4.75 18.62,4.75 H2.4
TXD: length 33.7
  Top Layer w0.152: H1.1 51.91,6.76 44.45,6.76 43.97,7.24 43.97,8.48 v1(43.51,8.94)
  Bottom Layer w0.152: v1(43.51,8.94) 43.28,8.71 25.58,8.71 H2.7
$1N75: length 3.2
  Top Layer w0.381: LED1.2 R3.2
$1N530: length 8
  Top Layer w0.762: R9.1 v1(42.53,21.2) R10.2
  Bottom Layer w0.762: v1(40.54,26.92) 42.53,24.94 v1(42.53,21.2)
$1N531: length 9.2
  Top Layer w0.762: U3.8 48.71,26.92 48.82,27.04 49.73,26.13 L1.1
$1N532: length 6
  Top Layer w0.381: U3.1 46.35,32.46 ; v1(46.35,29.18) C17.2
  Bottom Layer w0.381: v1(46.35,32.46) v1(46.35,29.18)
$1N535: length 3.7
  Top Layer w0.762: C14.2 41.81,25.01 ; 41.81,25.01 41.81,24.99 ; 41.81,25.01 U3.6 ; 41.81,25.01 42.49,25.01 C15.2
$1N536: length 2.3
  Top Layer w0.508: C12.2 40.25,33.74 40.54,33.45 U3.4
$1N538: length 6
  Top Layer w0.381: U3.3 41.81,33.15 41.02,33.93 41.02,36.54 41.01,36.55
  Top Layer w0.508: R4.1 R5.2
$1N1312: length 6.8
  Top Layer w0.482: 12.84,23.66 12.84,21.57 C23.1 ; U11.17 12.84,24.69 12.98,24.84 13.03,24.84 13.97,25.78 16,25.78
$1N1315: length 10.6
  Top Layer w0.482: U11.14 10.9,23.76 10.9,22.38 9.97,21.45 C29.1 ; 10.9,23.78 10.9,25.43
  Top Layer w0.508: 16,27.71 16,27.71 14.73,26.44 11.91,26.44 10.9,25.43 ; U11.14 10.9,23.78
$1N1336: length 3.8
  Top Layer w0.508: U11.20 15.92,23.77 16,23.85 16,21.78 C21.1
$1N1359: length 3.7
  Top Layer w0.508: C9.1 31.11,21.54 D4.1 31.03,23.77 29.9,23.77
$1N1370: length 10.1
  Top Layer w0.482: 26,22.35 U5.14
  Top Layer w0.508: D7.1 30.53,27.71 28.98,26.16 27.18,26.16 26,24.98 U5.14 ; C16.1 26,22.35
$1N1373: length 7.1
  Top Layer w0.482: D6.1 30.75,25.43 28.37,25.43 27.95,25 U5.17 27.95,21.56 C13.1
$1N1444: length 1.8
  Top Layer w0.762: R6.2 40.85,23.45 C14.1
$1N6010: length 6.1
  Top Layer w0.508: v1(40.97,14.12) 40.61,14.12 ; R14.2 40.13,18.77 R34.1 v1(40.13,18.19)
  内层2 w0.508: v1(40.13,18.19) 40.13,14.96 v1(40.97,14.12)
$1N6048: length 12.4
  Top Layer w0.508: v1(33.76,11.5) 34.5,11.5 ; v1(38.73,18.16) R13.2 R35.1
  内层2 w0.508: v1(38.73,18.16) 38.73,13.89 36.34,11.5 v1(33.76,11.5)
$1N6067: length 5.7
  Top Layer w0.508: v1(32.72,18.8) 32.16,18.8 R36.1 ; v1(33.07,14.15) 32.74,14.15
  内层2 w0.508: v1(32.72,18.8) 32.72,14.5 v1(33.07,14.15)
$1N6091: length 12.5
  Top Layer w0.508: R37.1 R12.2 v1(30.73,18.14) ; v1(25.88,11.5) 26.51,11.5
  内层2 w0.508: v1(25.88,11.5) 28.87,11.5 30.73,13.36 v1(30.73,18.14)
$1N6102: length 10.4
  Top Layer w0.508: v1(22.33,18.77) 23.01,18.77 ; 21.84,10.71 21.04,10.71 20.85,10.9 v1(20.85,11.38)
  内层2 w0.508: v1(22.33,18.77) 22.1,18.77 21.87,18.54 21.87,13.94 20.85,12.93 v1(20.85,11.38)
$1N6136: length 5.8
  Top Layer w0.559: v1(25.17,14.15) 24.63,14.15 Q11.4 ; v1(25.02,18.77) 24.41,18.77
  内层2 w0.559: v1(25.17,14.15) 25.17,18.62 v1(25.02,18.77)
$1N6143: length 11.2
  Top Layer w0.508: v1(3.86,18.82) 3.78,18.75 3.2,18.75 R23.2 R33.1 ; v1(2.39,10.12) 2.39,10.52
  内层2 w0.508: v1(3.86,18.82) 3.15,18.11 3.15,10.89 v1(2.39,10.12)
$1N6154: length 6.7
  Top Layer w0.508: v1(5.49,14.22) 5.36,14.1 4.84,14.1 4.83,14.11 ; v1(4.57,18.26) R22.2 R32.1
  内层2 w0.508: v1(5.49,14.22) 5.49,17.7 4.92,18.26 v1(4.57,18.26)
$1N6178: length 11.3
  Top Layer w0.152: v1(10.62,18.59) 10.64,18.62
  Top Layer w0.508: v1(6.78,10.82) 6.78,11.33 ; R30.1 R25.2
  内层2 w0.508: v1(6.78,10.82) 7.8,10.82 10.62,13.64 v1(10.62,18.59)
$1N6189: length 6.2
  Top Layer w0.508: R24.2 R31.1 ; v1(13.27,14.07) 12.85,14.07
  内层2 w0.508: v1(12.8,18.62) 13.06,18.62 13.44,18.24 13.44,14.24 v1(13.27,14.07)
$1N6225: length 13.6
  Top Layer w0.508: 14.52,11.55 13.9,11.55 13.71,11.74 v1(13.71,12.54) ; R29.1 R26.2 v1(18.85,18.14)
  内层2 w0.508: v1(18.85,18.14) 18.67,17.96 18.67,13.44 17.42,12.2 14.05,12.2 v1(13.71,12.54)
$1N6232: length 6.1
  Top Layer w0.508: v1(20.24,18.14) R28.1 R27.2 ; v1(21.12,14.15) 20.75,14.15
  内层2 w0.508: v1(20.24,18.14) 20.24,15.02 v1(21.12,14.15)

## Copper pours and planes (outline as drawn; the poured copper is in the pictures)
3V3 on Top Layer: 45.01,12.6 48.17,12.6 48.17,11.23 45.01,11.23
3V3 on Top Layer: 19.94,13.36 20.95,13.36 20.95,11.86 19.94,11.86
5V on Top Layer: 43.54,24.92 50.06,24.92 50.06,14.78 43.54,14.78
5V on 内层2: 16.9,31.71 19.79,31.71 19.79,30.26 16.9,30.26
5V on 内层2: 34.96,30.29 37,30.29 37,28.25 34.96,28.25
GND on Top Layer: 28.28,32.85 30.62,32.85 30.62,31.68 28.28,31.68
GND on Top Layer: 23.73,32.85 26.07,32.85 26.07,31.68 23.73,31.68
GND on Top Layer: 13.09,32.56 14.82,32.56 14.82,31.7 13.09,31.7
GND on Top Layer: 40.18,-0.08 56.39,-0.08 56.39,39.68 38.51,39.7 38.58,25.04 40.19,25.04
GND on Bottom Layer: 40.18,39.68 56.39,39.68 56.39,-0.08 40.18,-0.08
GND on 内层1: 40.18,39.68 56.39,39.68 56.39,-0.08 40.18,-0.08
GND on 内层2: 40.18,39.68 56.39,39.68 56.39,-0.08 40.18,-0.08
GND on 内层2: 32.32,8.31 34.38,8.31 34.38,7.34 32.32,7.34
PGND on Top Layer: 33.58,13.77 34.98,13.77 34.98,11.94 33.58,11.94
PGND on Top Layer: 13.72,14.3 15.09,14.3 15.09,12.75 13.72,12.75
PGND on Top Layer: 21.27,12.93 22.4,12.93 22.4,11.15 21.27,11.15
PGND on Top Layer: 14.17,13.79 15.09,13.79 15.09,11.96 14.17,11.96
PGND on Top Layer: 6.07,14.33 7.29,14.33 7.29,11.94 6.07,11.94
PGND on Top Layer: 1.55,12.93 2.9,12.93 2.9,11.1 1.55,11.1
PGND on Top Layer: 25.73,13.77 27.08,13.77 27.08,11.94 25.73,11.94
PGND on Top Layer: -0.1,-0.08 39.68,-0.08 39.73,23.95 37.95,23.95 37.95,37.85 37.95,39.68 -0.1,39.65
PGND on Bottom Layer: -0.1,39.65 39.68,39.65 39.68,-0.08 -0.1,-0.08
PGND on 内层1: -0.1,39.65 39.68,39.65 39.68,-0.08 -0.1,-0.08
PGND on 内层2: -0.18,14.4 39.57,14.4 39.57,-0.13 -0.18,-0.13
VIN on Top Layer: 13.21,36.96 16.26,36.96 16.26,34.42 13.21,34.42
VIN on Top Layer: 27.05,36.96 30.1,36.96 30.1,34.42 27.05,34.42
VIN on Top Layer: 2.11,17.63 41,17.63 41,14.86 2.11,14.86
VIN on Top Layer: 42.65,37.34 46.1,37.34 46.1,31.29 42.65,31.29
VIN on Bottom Layer: 2.11,17.63 41,17.63 41,14.86 2.11,14.86
VIN on Bottom Layer: 13.06,39.42 13.06,34.09 30.4,34.09 30.4,14.83 41,14.83 40.95,33.73 46.13,33.78 46.11,39.42
VIN on 内层2: -0.1,39.65 39.68,39.65 39.68,14.76 -0.1,14.76
M0_OUT1_N on Top Layer: 15.82,7.57 20.35,7.57 20.35,0.23 15.82,0.23
M0_OUT1_N on 内层2: 15.82,7.57 20.35,7.57 20.35,0.23 15.82,0.23
M0_OUT1_P on Top Layer: 15.34,14.63 20.17,14.63 20.17,9.14 15.34,9.14
M0_OUT2_N on Top Layer: 8.08,7.54 15.49,7.54 15.49,0.23 8.08,0.23
M0_OUT2_N on 内层2: 9.75,7.57 15.49,7.57 15.49,0.23 9.75,0.23
M0_OUT2_P on Top Layer: 7.47,14.63 12.29,14.63 12.29,9.14 7.47,9.14
M0_OUT3 on Top Layer: 2.57,14.63 5.87,14.63 5.87,10.29 2.57,10.29
M0_OUT3 on Top Layer: 3.15,10.89 10.97,10.89 10.97,0.23 3.15,0.23
M0_OUT3 on 内层2: 3.66,11.69 10.96,11.69 10.96,0.2 3.66,0.2
M1_OUT1_N on Top Layer: 31.85,7.57 37.57,7.57 37.57,0.18 31.85,0.18
M1_OUT1_N on 内层2: 31.85,7.57 37.57,7.57 37.57,0.18 31.85,0.18
M1_OUT1_P on Top Layer: 35.23,14.64 40.05,14.64 40.05,9.16 35.23,9.16
M1_OUT2_N on Top Layer: 26.31,7.62 30.38,7.62 30.38,0.18 26.31,0.18
M1_OUT2_N on 内层2: 26.31,7.62 30.61,7.62 30.61,0.18 26.31,0.18
M1_OUT2_P on Top Layer: 27.33,14.69 32.15,14.69 32.15,9.21 27.33,9.21
M1_OUT2_P on 内层2: 29.87,19.87 30.68,19.87 30.68,18.36 29.87,18.36
M1_OUT3 on Top Layer: 22.06,14.61 25.36,14.61 25.36,10.26 22.06,10.26
M1_OUT3 on Top Layer: 21.84,12.5 25.4,12.5 25.4,0.2 21.84,0.2
M1_OUT3 on 内层2: 21.84,7.68 25.43,7.68 25.43,0.18 21.84,0.18

Small or netless copper shapes (teardrops, artwork), in the pictures only: 268 on Top Layer, 32 on Bottom Layer, 12 on 内层2

## Text on the board
Bottom Silkscreen Layer: I_0  I_1 | G    5V | 3V3 3V3 | TX   RX | G    G | SCL_0 1 | SDA_0 1 | G   3V3 | 灯哥开源 FOC | V3 Plus | M0_A | M1_A
Top Silkscreen Layer: +   -
